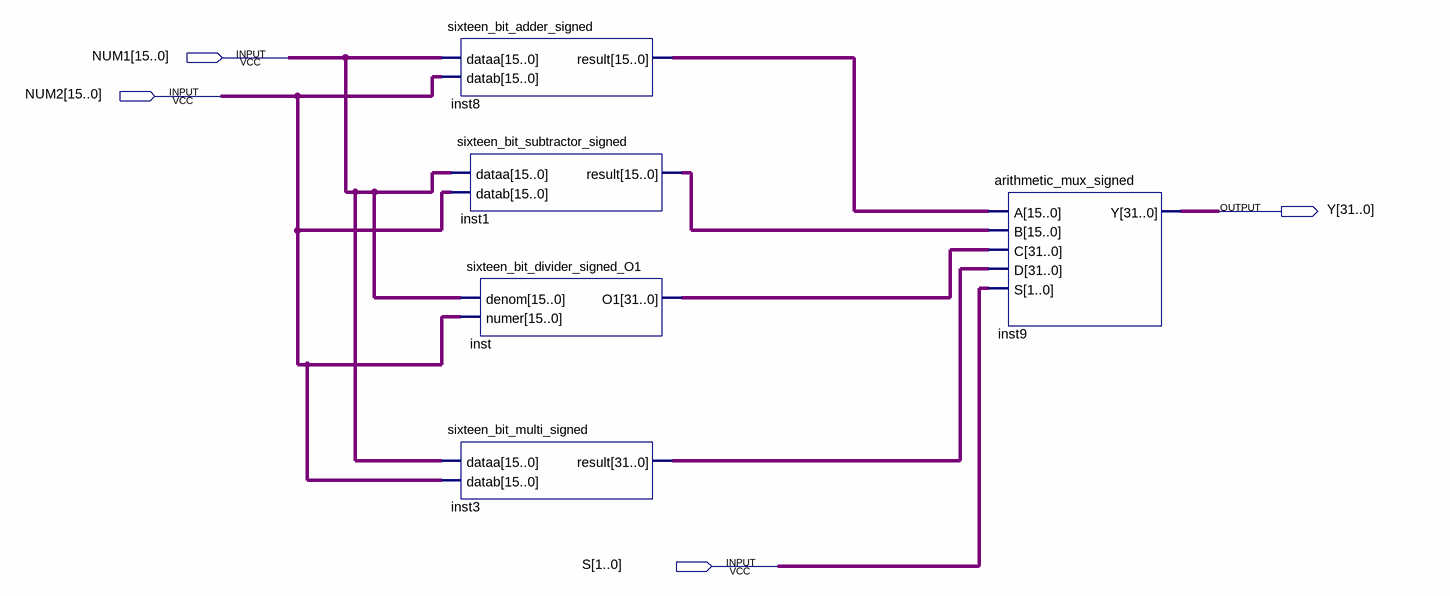
[diagram p0: schematic sheet]
// Quartus schematic arthemtic_ALU_signed.bdf as structural Verilog: 5 symbols, 4 pins
module arthemtic_ALU_signed (
  input  [15:0] NUM1,
  input  [15:0] NUM2,
  input  [1:0] S,
  output [31:0] Y
);

  wire [15:0] inst1_result, inst8_result;
  wire [31:0] inst3_result, inst_o1;

  sixteen_bit_adder_signed inst8 (.dataa(NUM1), .datab(NUM2), .result(inst8_result));
  sixteen_bit_subtractor_signed inst1 (.dataa(NUM1), .datab(NUM2), .result(inst1_result));
  sixteen_bit_divider_signed_O1 inst (.denom(NUM1), .numer(NUM2), .O1(inst_o1));
  sixteen_bit_multi_signed inst3 (.dataa(NUM1), .datab(NUM2), .result(inst3_result));
  arithmetic_mux_signed inst9 (.A(inst8_result), .B(inst1_result), .C(inst_o1), .D(inst3_result), .S(S), .Y(Y));
endmodule
